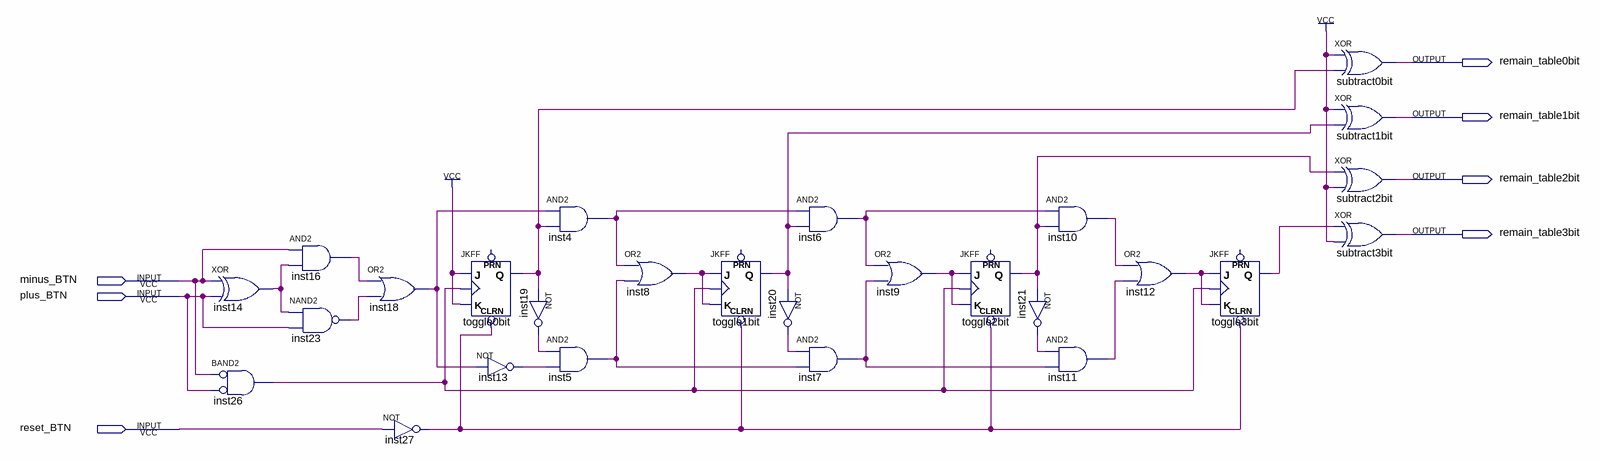
[diagram p0: schematic sheet]
// Quartus schematic remain_table.bdf as structural Verilog: 27 symbols, 7 pins
module remain_table (
  input  minus_BTN,
  input  plus_BTN,
  input  reset_BTN,
  output remain_table0bit,
  output remain_table1bit,
  output remain_table2bit,
  output remain_table3bit
);

  wire inst4_out, inst5_out, inst6_out, inst7_out, inst8_out, inst9_out, inst10_out, inst11_out, inst12_out,
       inst13_out, inst14_out, inst16_out, inst18_out, inst19_out, inst20_out, inst21_out, inst23_out,
       inst26_out, inst27_out, toggle0bit_q, toggle1bit_q, toggle2bit_q, toggle3bit_q;

  xor inst14 (inst14_out, minus_BTN, plus_BTN);
  and inst26 (inst26_out, ~minus_BTN, ~plus_BTN);  // BAND2
  and inst16 (inst16_out, minus_BTN, inst14_out);
  nand inst23 (inst23_out, inst14_out, plus_BTN);
  or inst18 (inst18_out, inst16_out, inst23_out);
  not inst27 (inst27_out, reset_BTN);
  JKFF toggle0bit (.CLRN(inst27_out), .K(1'b1), .J(1'b1), .CLK(inst26_out), .Q(toggle0bit_q));  // open: PRN
  not inst13 (inst13_out, inst18_out);
  and inst4 (inst4_out, inst18_out, toggle0bit_q);
  not inst19 (inst19_out, toggle0bit_q);
  and inst5 (inst5_out, inst19_out, inst13_out);
  or inst8 (inst8_out, inst4_out, inst5_out);
  JKFF toggle1bit (.CLRN(inst27_out), .K(inst8_out), .J(inst8_out), .CLK(inst26_out), .Q(toggle1bit_q));  // open: PRN
  and inst6 (inst6_out, inst4_out, toggle1bit_q);
  not inst20 (inst20_out, toggle1bit_q);
  and inst7 (inst7_out, inst20_out, inst5_out);
  or inst9 (inst9_out, inst6_out, inst7_out);
  JKFF toggle2bit (.CLRN(inst27_out), .K(inst9_out), .J(inst9_out), .CLK(inst26_out), .Q(toggle2bit_q));  // open: PRN
  and inst10 (inst10_out, inst6_out, toggle2bit_q);
  not inst21 (inst21_out, toggle2bit_q);
  and inst11 (inst11_out, inst21_out, inst7_out);
  or inst12 (inst12_out, inst10_out, inst11_out);
  JKFF toggle3bit (.CLRN(inst27_out), .K(inst12_out), .J(inst12_out), .CLK(inst26_out), .Q(toggle3bit_q));  // open: PRN
  xor subtract0bit (remain_table0bit, 1'b1, toggle0bit_q);
  xor subtract1bit (remain_table1bit, 1'b1, toggle1bit_q);
  xor subtract2bit (remain_table2bit, toggle2bit_q, 1'b1);
  xor subtract3bit (remain_table3bit, toggle3bit_q, 1'b1);
endmodule
